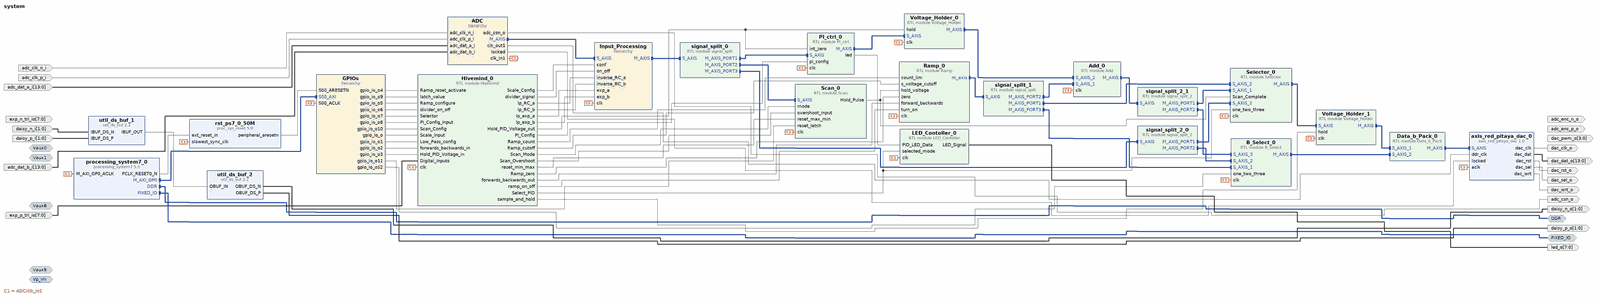
[diagram p0: block diagram of the top level, whole]
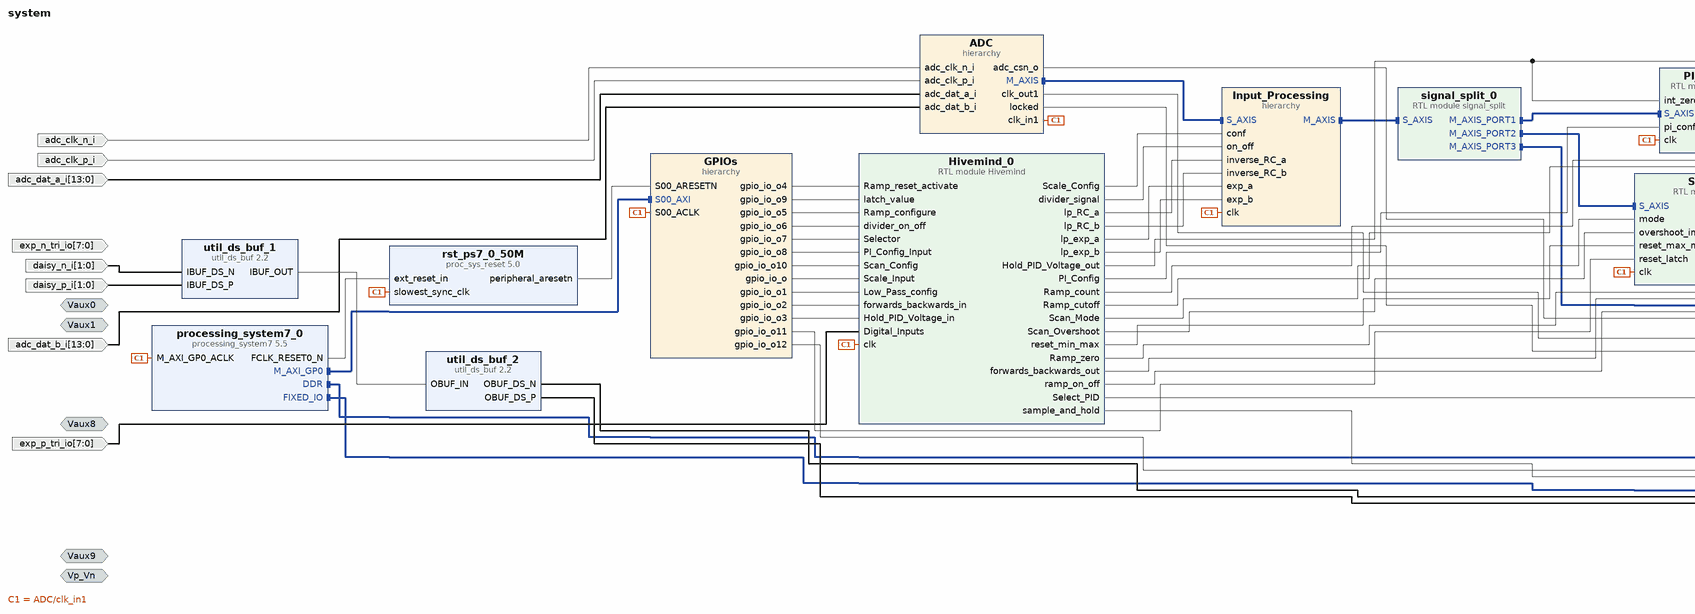
[diagram p1: block diagram of the top level, left part]
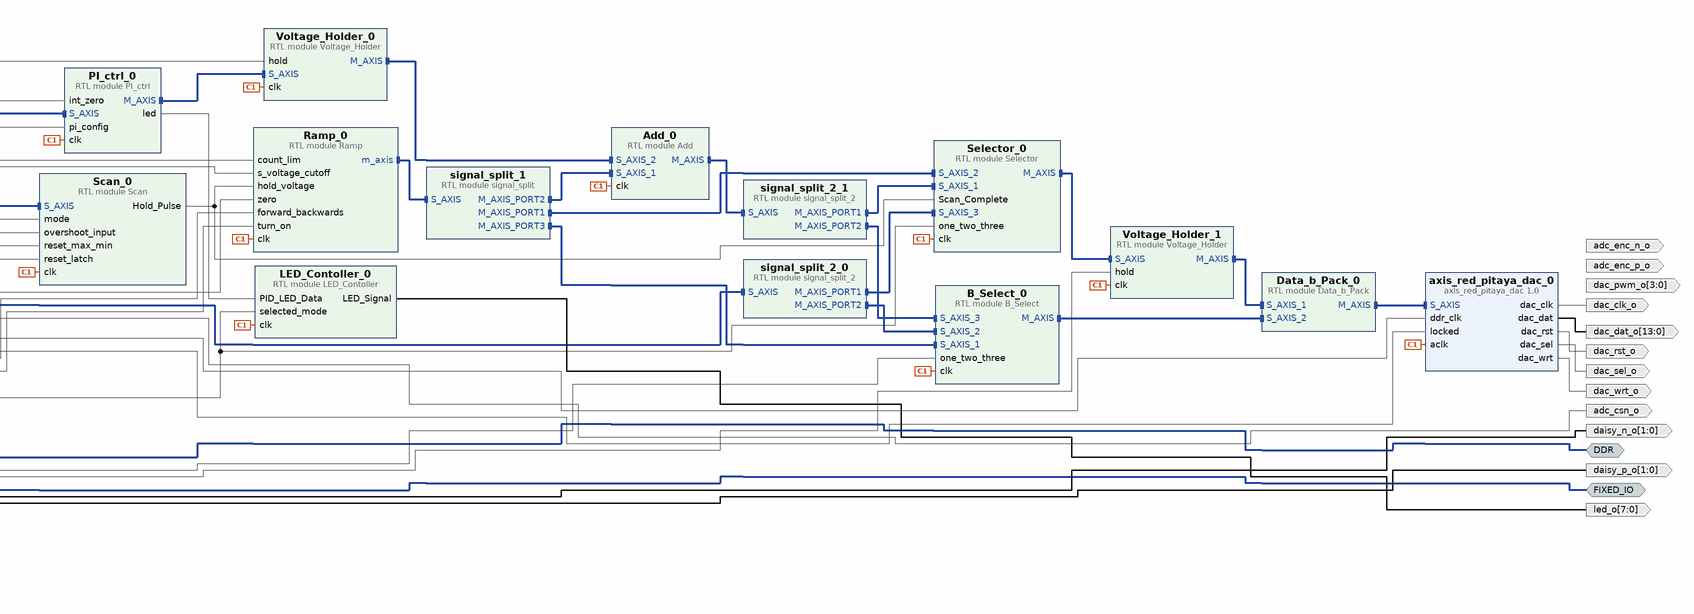
[diagram p2: block diagram of the top level, right part]
# Vivado block design system, xc7z010clg400-1, Vivado 2022.1
create_bd_design system

create_bd_intf_port -mode Slave -vlnv xilinx.com:interface:diff_analog_io_rtl:1.0 Vp_Vn
create_bd_intf_port -mode Slave -vlnv xilinx.com:interface:diff_analog_io_rtl:1.0 Vaux0
create_bd_intf_port -mode Slave -vlnv xilinx.com:interface:diff_analog_io_rtl:1.0 Vaux1
create_bd_intf_port -mode Slave -vlnv xilinx.com:interface:diff_analog_io_rtl:1.0 Vaux9
create_bd_intf_port -mode Slave -vlnv xilinx.com:interface:diff_analog_io_rtl:1.0 Vaux8
create_bd_intf_port -mode Master -vlnv xilinx.com:interface:ddrx_rtl:1.0 DDR
create_bd_intf_port -mode Master -vlnv xilinx.com:display_processing_system7:fixedio_rtl:1.0 FIXED_IO
create_bd_port -dir I -from 13 -to 0 adc_dat_a_i
create_bd_port -dir I -from 13 -to 0 adc_dat_b_i
create_bd_port -dir I adc_clk_p_i
create_bd_port -dir I adc_clk_n_i
create_bd_port -dir O adc_enc_p_o
create_bd_port -dir O adc_enc_n_o
create_bd_port -dir O adc_csn_o
create_bd_port -dir O -from 13 -to 0 dac_dat_o
create_bd_port -dir O dac_clk_o
create_bd_port -dir O dac_rst_o
create_bd_port -dir O dac_sel_o
create_bd_port -dir O dac_wrt_o
create_bd_port -dir O -from 3 -to 0 dac_pwm_o
create_bd_port -dir O -from 1 -to 0 daisy_p_o
create_bd_port -dir O -from 1 -to 0 daisy_n_o
create_bd_port -dir I -from 1 -to 0 daisy_p_i
create_bd_port -dir I -from 1 -to 0 daisy_n_i
create_bd_port -dir O -from 7 -to 0 led_o
create_bd_port -dir I -from 7 -to 0 exp_p_tri_io
create_bd_port -dir I -from 7 -to 0 exp_n_tri_io

create_bd_cell -type ip -vlnv xilinx.com:ip:util_ds_buf:2.2 util_ds_buf_1
set_property -dict {CONFIG.C_SIZE 2} [get_bd_cells util_ds_buf_1]
create_bd_cell -type ip -vlnv xilinx.com:ip:util_ds_buf:2.2 util_ds_buf_2
set_property -dict {CONFIG.C_BUF_TYPE OBUFDS CONFIG.C_SIZE 2} [get_bd_cells util_ds_buf_2]
create_bd_cell -type ip -vlnv pavel-demin:user:axis_red_pitaya_dac:1.0 axis_red_pitaya_dac_0
create_bd_cell -type hier ADC
create_bd_cell -type hier Input_Processing
create_bd_cell -type module -reference signal_split signal_split_0
create_bd_cell -type module -reference signal_split_2 signal_split_2_0
create_bd_cell -type module -reference LED_Contoller LED_Contoller_0
create_bd_cell -type module -reference PI_ctrl PI_ctrl_0
create_bd_cell -type module -reference Selector Selector_0
create_bd_cell -type module -reference Scan Scan_0
create_bd_cell -type module -reference Voltage_Holder Voltage_Holder_0
create_bd_cell -type module -reference Voltage_Holder Voltage_Holder_1
create_bd_cell -type hier GPIOs
create_bd_cell -type module -reference Hivemind Hivemind_0
create_bd_cell -type module -reference Ramp Ramp_0
create_bd_cell -type ip -vlnv xilinx.com:ip:processing_system7:5.5 processing_system7_0
# 1 more settings of processing_system7_0 are not shown: defaults, MIO pin electricals, DDR timing, and values the tool derives
create_bd_cell -type ip -vlnv xilinx.com:ip:proc_sys_reset:5.0 rst_ps7_0_50M
create_bd_cell -type module -reference Add Add_0
create_bd_cell -type module -reference signal_split signal_split_1
create_bd_cell -type module -reference signal_split_2 signal_split_2_1
create_bd_cell -type module -reference B_Select B_Select_0
create_bd_cell -type module -reference Data_b_Pack Data_b_Pack_0

# ---- hierarchy /ADC ----
current_bd_instance /ADC
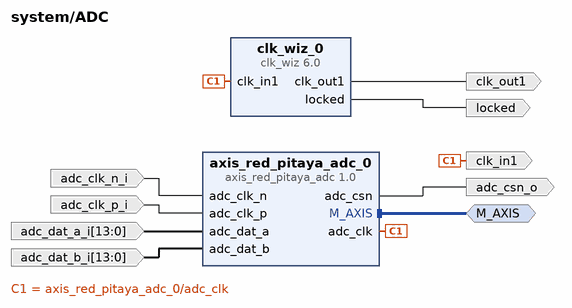
[diagram p3: block diagram inside /ADC]
create_bd_intf_pin -mode Master -vlnv xilinx.com:interface:axis_rtl:1.0 M_AXIS
create_bd_pin -dir O -type clk clk_in1
create_bd_pin -dir O adc_csn_o
create_bd_pin -dir I adc_clk_p_i
create_bd_pin -dir I adc_clk_n_i
create_bd_pin -dir I -from 13 -to 0 adc_dat_a_i
create_bd_pin -dir I -from 13 -to 0 adc_dat_b_i
create_bd_pin -dir O -type clk clk_out1
create_bd_pin -dir O locked

create_bd_cell -type ip -vlnv pavel-demin:user:axis_red_pitaya_adc:1.0 axis_red_pitaya_adc_0
create_bd_cell -type ip -vlnv xilinx.com:ip:clk_wiz:6.0 clk_wiz_0
set_property -dict [list \
  CONFIG.CLKIN1_JITTER_PS 80.0 \
  CONFIG.CLKOUT1_JITTER 104.759 \
  CONFIG.CLKOUT1_PHASE_ERROR 96.948 \
  CONFIG.CLKOUT1_REQUESTED_OUT_FREQ 250 \
  CONFIG.CLKOUT1_REQUESTED_PHASE 157.5 \
  CONFIG.MMCM_CLKFBOUT_MULT_F 8.000 \
  CONFIG.MMCM_CLKIN1_PERIOD 8.000 \
  CONFIG.MMCM_CLKOUT0_DIVIDE_F 4.000 \
  CONFIG.MMCM_CLKOUT0_PHASE 157.500 \
  CONFIG.PRIM_IN_FREQ 125 \
  CONFIG.USE_RESET false \
] [get_bd_cells clk_wiz_0]

# ---- hierarchy /Input_Processing ----
current_bd_instance /Input_Processing
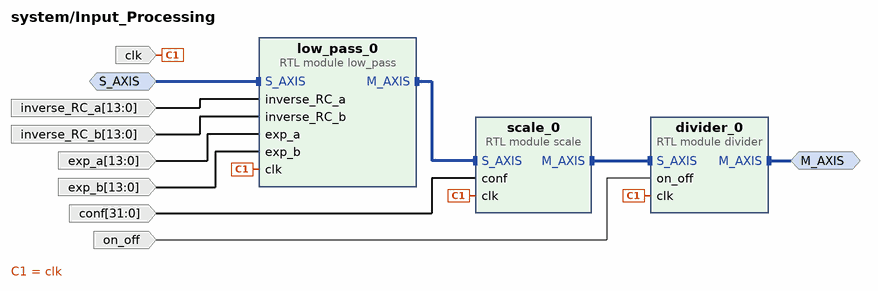
[diagram p4: block diagram inside /Input_Processing]
create_bd_intf_pin -mode Slave -vlnv xilinx.com:interface:axis_rtl:1.0 S_AXIS
create_bd_intf_pin -mode Master -vlnv xilinx.com:interface:axis_rtl:1.0 M_AXIS
create_bd_pin -dir I -type clk clk
create_bd_pin -dir I -from 13 -to 0 inverse_RC_a
create_bd_pin -dir I -from 13 -to 0 inverse_RC_b
create_bd_pin -dir I -from 13 -to 0 exp_a
create_bd_pin -dir I -from 13 -to 0 exp_b
create_bd_pin -dir I on_off
create_bd_pin -dir I -from 31 -to 0 conf

create_bd_cell -type module -reference low_pass low_pass_0
create_bd_cell -type module -reference scale scale_0
create_bd_cell -type module -reference divider divider_0

# ---- hierarchy /GPIOs ----
current_bd_instance /GPIOs
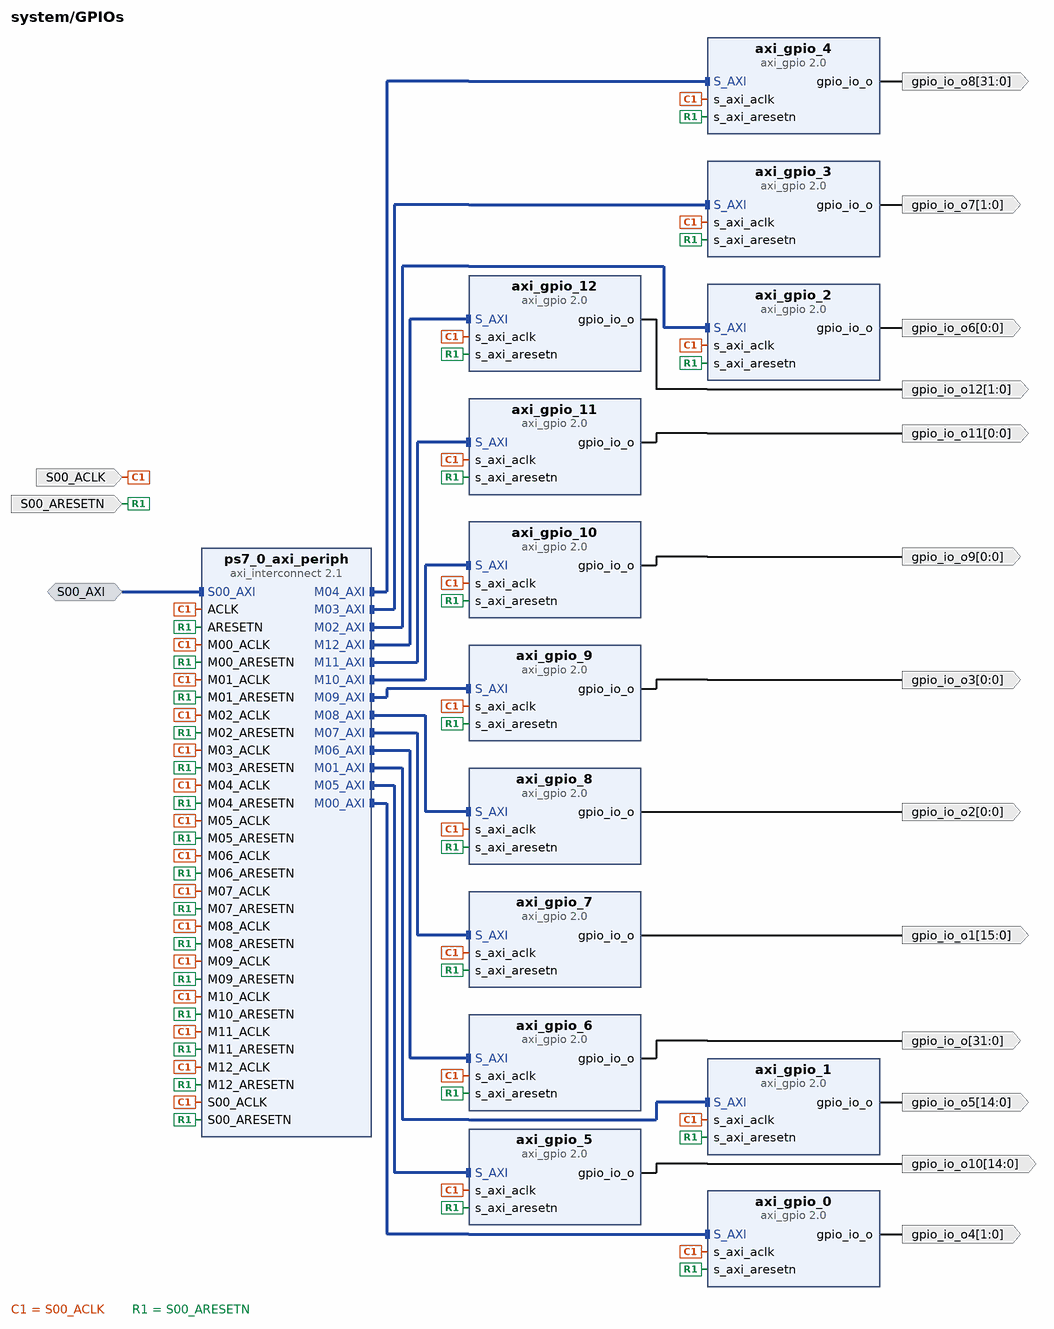
[diagram p5: block diagram inside /GPIOs]
create_bd_intf_pin -mode Slave -vlnv xilinx.com:interface:aximm_rtl:1.0 S00_AXI
create_bd_pin -dir I -type clk S00_ACLK
create_bd_pin -dir I -type rst S00_ARESETN
create_bd_pin -dir O -from 31 -to 0 gpio_io_o
create_bd_pin -dir O -from 15 -to 0 gpio_io_o1
create_bd_pin -dir O -from 0 -to 0 gpio_io_o2
create_bd_pin -dir O -from 0 -to 0 gpio_io_o3
create_bd_pin -dir O -from 1 -to 0 gpio_io_o4
create_bd_pin -dir O -from 14 -to 0 gpio_io_o5
create_bd_pin -dir O -from 0 -to 0 gpio_io_o6
create_bd_pin -dir O -from 1 -to 0 gpio_io_o7
create_bd_pin -dir O -from 31 -to 0 gpio_io_o8
create_bd_pin -dir O -from 0 -to 0 gpio_io_o9
create_bd_pin -dir O -from 14 -to 0 gpio_io_o10
create_bd_pin -dir O -from 0 -to 0 gpio_io_o11
create_bd_pin -dir O -from 1 -to 0 gpio_io_o12

create_bd_cell -type ip -vlnv xilinx.com:ip:axi_gpio:2.0 axi_gpio_6
set_property -dict {CONFIG.C_ALL_OUTPUTS 1 CONFIG.C_GPIO_WIDTH 32} [get_bd_cells axi_gpio_6]
create_bd_cell -type ip -vlnv xilinx.com:ip:axi_gpio:2.0 axi_gpio_7
set_property -dict {CONFIG.C_ALL_OUTPUTS 1 CONFIG.C_GPIO_WIDTH 16} [get_bd_cells axi_gpio_7]
create_bd_cell -type ip -vlnv xilinx.com:ip:axi_gpio:2.0 axi_gpio_8
set_property -dict {CONFIG.C_ALL_OUTPUTS 1 CONFIG.C_GPIO_WIDTH 1} [get_bd_cells axi_gpio_8]
create_bd_cell -type ip -vlnv xilinx.com:ip:axi_gpio:2.0 axi_gpio_9
set_property -dict {CONFIG.C_ALL_OUTPUTS 1 CONFIG.C_GPIO_WIDTH 1} [get_bd_cells axi_gpio_9]
create_bd_cell -type ip -vlnv xilinx.com:ip:axi_gpio:2.0 axi_gpio_0
set_property -dict {CONFIG.C_ALL_OUTPUTS 1 CONFIG.C_GPIO_WIDTH 2} [get_bd_cells axi_gpio_0]
create_bd_cell -type ip -vlnv xilinx.com:ip:axi_gpio:2.0 axi_gpio_1
set_property -dict {CONFIG.C_ALL_OUTPUTS 1 CONFIG.C_GPIO_WIDTH 15} [get_bd_cells axi_gpio_1]
create_bd_cell -type ip -vlnv xilinx.com:ip:axi_gpio:2.0 axi_gpio_2
set_property -dict {CONFIG.C_ALL_OUTPUTS 1 CONFIG.C_GPIO_WIDTH 1} [get_bd_cells axi_gpio_2]
create_bd_cell -type ip -vlnv xilinx.com:ip:axi_gpio:2.0 axi_gpio_3
set_property -dict {CONFIG.C_ALL_OUTPUTS 1 CONFIG.C_GPIO_WIDTH 2} [get_bd_cells axi_gpio_3]
create_bd_cell -type ip -vlnv xilinx.com:ip:axi_gpio:2.0 axi_gpio_4
set_property -dict {CONFIG.C_ALL_OUTPUTS 1 CONFIG.C_GPIO_WIDTH 32} [get_bd_cells axi_gpio_4]
create_bd_cell -type ip -vlnv xilinx.com:ip:axi_gpio:2.0 axi_gpio_10
set_property -dict {CONFIG.C_ALL_OUTPUTS 1 CONFIG.C_GPIO_WIDTH 1} [get_bd_cells axi_gpio_10]
create_bd_cell -type ip -vlnv xilinx.com:ip:axi_gpio:2.0 axi_gpio_5
set_property -dict {CONFIG.C_ALL_OUTPUTS 1 CONFIG.C_GPIO_WIDTH 15} [get_bd_cells axi_gpio_5]
create_bd_cell -type ip -vlnv xilinx.com:ip:axi_gpio:2.0 axi_gpio_11
set_property -dict {CONFIG.C_ALL_OUTPUTS 1 CONFIG.C_GPIO_WIDTH 1} [get_bd_cells axi_gpio_11]
create_bd_cell -type ip -vlnv xilinx.com:ip:axi_interconnect:2.1 ps7_0_axi_periph
set_property -dict {CONFIG.NUM_MI 13} [get_bd_cells ps7_0_axi_periph]
create_bd_cell -type ip -vlnv xilinx.com:ip:axi_gpio:2.0 axi_gpio_12
set_property -dict {CONFIG.C_ALL_OUTPUTS 1 CONFIG.C_GPIO_WIDTH 2} [get_bd_cells axi_gpio_12]

# ---- connections ----

current_bd_instance /ADC
connect_bd_intf_net [get_bd_intf_pins M_AXIS] [get_bd_intf_pins axis_red_pitaya_adc_0/M_AXIS]
connect_bd_net [get_bd_pins adc_clk_n_i] [get_bd_pins axis_red_pitaya_adc_0/adc_clk_n]
connect_bd_net [get_bd_pins adc_clk_p_i] [get_bd_pins axis_red_pitaya_adc_0/adc_clk_p]
connect_bd_net [get_bd_pins adc_dat_a_i] [get_bd_pins axis_red_pitaya_adc_0/adc_dat_a]
connect_bd_net [get_bd_pins adc_dat_b_i] [get_bd_pins axis_red_pitaya_adc_0/adc_dat_b]
connect_bd_net [get_bd_pins axis_red_pitaya_adc_0/adc_clk] [get_bd_pins clk_in1] [get_bd_pins clk_wiz_0/clk_in1]
connect_bd_net [get_bd_pins axis_red_pitaya_adc_0/adc_csn] [get_bd_pins adc_csn_o]
connect_bd_net [get_bd_pins clk_wiz_0/clk_out1] [get_bd_pins clk_out1]
connect_bd_net [get_bd_pins clk_wiz_0/locked] [get_bd_pins locked]

current_bd_instance /Input_Processing
connect_bd_intf_net -intf_net axis_red_pitaya_adc_0_M_AXIS [get_bd_intf_pins S_AXIS] [get_bd_intf_pins low_pass_0/S_AXIS]
connect_bd_intf_net [get_bd_intf_pins M_AXIS] [get_bd_intf_pins divider_0/M_AXIS]
connect_bd_intf_net [get_bd_intf_pins low_pass_0/M_AXIS] [get_bd_intf_pins scale_0/S_AXIS]
connect_bd_intf_net [get_bd_intf_pins scale_0/M_AXIS] [get_bd_intf_pins divider_0/S_AXIS]
connect_bd_net -net Controller_Scale_Config [get_bd_pins conf] [get_bd_pins scale_0/conf]
connect_bd_net -net Controller_lp_RC_a [get_bd_pins inverse_RC_a] [get_bd_pins low_pass_0/inverse_RC_a]
connect_bd_net -net Controller_lp_RC_b [get_bd_pins inverse_RC_b] [get_bd_pins low_pass_0/inverse_RC_b]
connect_bd_net -net Controller_lp_exp_a [get_bd_pins exp_a] [get_bd_pins low_pass_0/exp_a]
connect_bd_net -net Controller_lp_exp_b [get_bd_pins exp_b] [get_bd_pins low_pass_0/exp_b]
connect_bd_net -net Hivemind_0_divider_signal [get_bd_pins on_off] [get_bd_pins divider_0/on_off]
connect_bd_net -net axis_red_pitaya_adc_0_adc_clk [get_bd_pins clk] [get_bd_pins scale_0/clk] [get_bd_pins low_pass_0/clk] [get_bd_pins divider_0/clk]

current_bd_instance /GPIOs
connect_bd_intf_net -intf_net processing_system7_0_M_AXI_GP0 [get_bd_intf_pins S00_AXI] [get_bd_intf_pins ps7_0_axi_periph/S00_AXI]
connect_bd_intf_net [get_bd_intf_pins ps7_0_axi_periph/M00_AXI] [get_bd_intf_pins axi_gpio_0/S_AXI]
connect_bd_intf_net [get_bd_intf_pins ps7_0_axi_periph/M01_AXI] [get_bd_intf_pins axi_gpio_1/S_AXI]
connect_bd_intf_net [get_bd_intf_pins ps7_0_axi_periph/M02_AXI] [get_bd_intf_pins axi_gpio_2/S_AXI]
connect_bd_intf_net [get_bd_intf_pins ps7_0_axi_periph/M03_AXI] [get_bd_intf_pins axi_gpio_3/S_AXI]
connect_bd_intf_net [get_bd_intf_pins ps7_0_axi_periph/M04_AXI] [get_bd_intf_pins axi_gpio_4/S_AXI]
connect_bd_intf_net [get_bd_intf_pins ps7_0_axi_periph/M05_AXI] [get_bd_intf_pins axi_gpio_5/S_AXI]
connect_bd_intf_net [get_bd_intf_pins ps7_0_axi_periph/M06_AXI] [get_bd_intf_pins axi_gpio_6/S_AXI]
connect_bd_intf_net [get_bd_intf_pins ps7_0_axi_periph/M07_AXI] [get_bd_intf_pins axi_gpio_7/S_AXI]
connect_bd_intf_net [get_bd_intf_pins ps7_0_axi_periph/M08_AXI] [get_bd_intf_pins axi_gpio_8/S_AXI]
connect_bd_intf_net [get_bd_intf_pins ps7_0_axi_periph/M09_AXI] [get_bd_intf_pins axi_gpio_9/S_AXI]
connect_bd_intf_net [get_bd_intf_pins ps7_0_axi_periph/M10_AXI] [get_bd_intf_pins axi_gpio_10/S_AXI]
connect_bd_intf_net [get_bd_intf_pins ps7_0_axi_periph/M11_AXI] [get_bd_intf_pins axi_gpio_11/S_AXI]
connect_bd_intf_net [get_bd_intf_pins ps7_0_axi_periph/M12_AXI] [get_bd_intf_pins axi_gpio_12/S_AXI]
connect_bd_net [get_bd_pins axi_gpio_0/gpio_io_o] [get_bd_pins gpio_io_o4]
connect_bd_net [get_bd_pins axi_gpio_10/gpio_io_o] [get_bd_pins gpio_io_o9]
connect_bd_net [get_bd_pins axi_gpio_11/gpio_io_o] [get_bd_pins gpio_io_o11]
connect_bd_net [get_bd_pins axi_gpio_12/gpio_io_o] [get_bd_pins gpio_io_o12]
connect_bd_net [get_bd_pins axi_gpio_1/gpio_io_o] [get_bd_pins gpio_io_o5]
connect_bd_net [get_bd_pins axi_gpio_2/gpio_io_o] [get_bd_pins gpio_io_o6]
connect_bd_net [get_bd_pins axi_gpio_3/gpio_io_o] [get_bd_pins gpio_io_o7]
connect_bd_net [get_bd_pins axi_gpio_4/gpio_io_o] [get_bd_pins gpio_io_o8]
connect_bd_net [get_bd_pins axi_gpio_5/gpio_io_o] [get_bd_pins gpio_io_o10]
connect_bd_net [get_bd_pins axi_gpio_6/gpio_io_o] [get_bd_pins gpio_io_o]
connect_bd_net [get_bd_pins axi_gpio_7/gpio_io_o] [get_bd_pins gpio_io_o1]
connect_bd_net [get_bd_pins axi_gpio_8/gpio_io_o] [get_bd_pins gpio_io_o2]
connect_bd_net [get_bd_pins axi_gpio_9/gpio_io_o] [get_bd_pins gpio_io_o3]
connect_bd_net -net processing_system7_0_FCLK_CLK0 [get_bd_pins S00_ACLK] \
  [get_bd_pins ps7_0_axi_periph/S00_ACLK] [get_bd_pins axi_gpio_0/s_axi_aclk] [get_bd_pins ps7_0_axi_periph/M00_ACLK] \
  [get_bd_pins ps7_0_axi_periph/ACLK] [get_bd_pins axi_gpio_1/s_axi_aclk] [get_bd_pins ps7_0_axi_periph/M01_ACLK] \
  [get_bd_pins axi_gpio_2/s_axi_aclk] [get_bd_pins ps7_0_axi_periph/M02_ACLK] [get_bd_pins axi_gpio_3/s_axi_aclk] \
  [get_bd_pins ps7_0_axi_periph/M03_ACLK] [get_bd_pins axi_gpio_4/s_axi_aclk] [get_bd_pins ps7_0_axi_periph/M04_ACLK] \
  [get_bd_pins axi_gpio_5/s_axi_aclk] [get_bd_pins ps7_0_axi_periph/M05_ACLK] [get_bd_pins ps7_0_axi_periph/M06_ACLK] \
  [get_bd_pins axi_gpio_7/s_axi_aclk] [get_bd_pins ps7_0_axi_periph/M07_ACLK] [get_bd_pins axi_gpio_8/s_axi_aclk] \
  [get_bd_pins ps7_0_axi_periph/M08_ACLK] [get_bd_pins axi_gpio_9/s_axi_aclk] [get_bd_pins ps7_0_axi_periph/M09_ACLK] \
  [get_bd_pins axi_gpio_10/s_axi_aclk] [get_bd_pins ps7_0_axi_periph/M10_ACLK] [get_bd_pins axi_gpio_11/s_axi_aclk] \
  [get_bd_pins ps7_0_axi_periph/M11_ACLK] [get_bd_pins axi_gpio_6/s_axi_aclk] [get_bd_pins ps7_0_axi_periph/M12_ACLK] \
  [get_bd_pins axi_gpio_12/s_axi_aclk]
connect_bd_net -net rst_ps7_0_50M_peripheral_aresetn [get_bd_pins S00_ARESETN] \
  [get_bd_pins ps7_0_axi_periph/S00_ARESETN] [get_bd_pins axi_gpio_0/s_axi_aresetn] \
  [get_bd_pins ps7_0_axi_periph/M00_ARESETN] [get_bd_pins ps7_0_axi_periph/ARESETN] [get_bd_pins axi_gpio_1/s_axi_aresetn] \
  [get_bd_pins ps7_0_axi_periph/M01_ARESETN] [get_bd_pins axi_gpio_2/s_axi_aresetn] \
  [get_bd_pins ps7_0_axi_periph/M02_ARESETN] [get_bd_pins axi_gpio_3/s_axi_aresetn] \
  [get_bd_pins ps7_0_axi_periph/M03_ARESETN] [get_bd_pins axi_gpio_4/s_axi_aresetn] \
  [get_bd_pins ps7_0_axi_periph/M04_ARESETN] [get_bd_pins axi_gpio_5/s_axi_aresetn] \
  [get_bd_pins ps7_0_axi_periph/M05_ARESETN] [get_bd_pins ps7_0_axi_periph/M06_ARESETN] \
  [get_bd_pins axi_gpio_7/s_axi_aresetn] [get_bd_pins ps7_0_axi_periph/M07_ARESETN] [get_bd_pins axi_gpio_8/s_axi_aresetn] \
  [get_bd_pins ps7_0_axi_periph/M08_ARESETN] [get_bd_pins axi_gpio_9/s_axi_aresetn] \
  [get_bd_pins ps7_0_axi_periph/M09_ARESETN] [get_bd_pins axi_gpio_10/s_axi_aresetn] \
  [get_bd_pins ps7_0_axi_periph/M10_ARESETN] [get_bd_pins axi_gpio_11/s_axi_aresetn] \
  [get_bd_pins ps7_0_axi_periph/M11_ARESETN] [get_bd_pins axi_gpio_6/s_axi_aresetn] \
  [get_bd_pins ps7_0_axi_periph/M12_ARESETN] [get_bd_pins axi_gpio_12/s_axi_aresetn]

current_bd_instance /
connect_bd_intf_net [get_bd_intf_pins Add_0/M_AXIS] [get_bd_intf_pins signal_split_2_1/S_AXIS]
connect_bd_intf_net [get_bd_intf_pins B_Select_0/M_AXIS] [get_bd_intf_pins Data_b_Pack_0/S_AXIS_2]
connect_bd_intf_net [get_bd_intf_pins Data_b_Pack_0/M_AXIS] [get_bd_intf_pins axis_red_pitaya_dac_0/S_AXIS]
connect_bd_intf_net [get_bd_intf_pins Input_Processing/M_AXIS] [get_bd_intf_pins signal_split_0/S_AXIS]
connect_bd_intf_net [get_bd_intf_pins PI_ctrl_0/M_AXIS] [get_bd_intf_pins Voltage_Holder_0/S_AXIS]
connect_bd_intf_net [get_bd_intf_pins Ramp_0/m_axis] [get_bd_intf_pins signal_split_1/S_AXIS]
connect_bd_intf_net [get_bd_intf_pins Selector_0/M_AXIS] [get_bd_intf_pins Voltage_Holder_1/S_AXIS]
connect_bd_intf_net [get_bd_intf_pins Voltage_Holder_0/M_AXIS] [get_bd_intf_pins Add_0/S_AXIS_2]
connect_bd_intf_net [get_bd_intf_pins Voltage_Holder_1/M_AXIS] [get_bd_intf_pins Data_b_Pack_0/S_AXIS_1]
connect_bd_intf_net -intf_net axis_red_pitaya_adc_0_M_AXIS [get_bd_intf_pins Input_Processing/S_AXIS] [get_bd_intf_pins ADC/M_AXIS]
connect_bd_intf_net [get_bd_intf_ports DDR] [get_bd_intf_pins processing_system7_0/DDR]
connect_bd_intf_net [get_bd_intf_ports FIXED_IO] [get_bd_intf_pins processing_system7_0/FIXED_IO]
connect_bd_intf_net [get_bd_intf_pins processing_system7_0/M_AXI_GP0] [get_bd_intf_pins GPIOs/S00_AXI]
connect_bd_intf_net [get_bd_intf_pins signal_split_0/M_AXIS_PORT1] [get_bd_intf_pins PI_ctrl_0/S_AXIS]
connect_bd_intf_net [get_bd_intf_pins signal_split_0/M_AXIS_PORT2] [get_bd_intf_pins Scan_0/S_AXIS]
connect_bd_intf_net [get_bd_intf_pins signal_split_0/M_AXIS_PORT3] [get_bd_intf_pins signal_split_2_0/S_AXIS]
connect_bd_intf_net [get_bd_intf_pins signal_split_1/M_AXIS_PORT1] [get_bd_intf_pins Selector_0/S_AXIS_2]
connect_bd_intf_net [get_bd_intf_pins signal_split_1/M_AXIS_PORT2] [get_bd_intf_pins Add_0/S_AXIS_1]
connect_bd_intf_net [get_bd_intf_pins signal_split_1/M_AXIS_PORT3] [get_bd_intf_pins B_Select_0/S_AXIS_1]
connect_bd_intf_net [get_bd_intf_pins signal_split_2_0/M_AXIS_PORT1] [get_bd_intf_pins Selector_0/S_AXIS_3]
connect_bd_intf_net [get_bd_intf_pins signal_split_2_0/M_AXIS_PORT2] [get_bd_intf_pins B_Select_0/S_AXIS_2]
connect_bd_intf_net [get_bd_intf_pins signal_split_2_1/M_AXIS_PORT1] [get_bd_intf_pins Selector_0/S_AXIS_1]
connect_bd_intf_net [get_bd_intf_pins signal_split_2_1/M_AXIS_PORT2] [get_bd_intf_pins B_Select_0/S_AXIS_3]
connect_bd_net [get_bd_pins GPIOs/gpio_io_o12] [get_bd_pins B_Select_0/one_two_three]
connect_bd_net [get_bd_pins Hivemind_0/Hold_PID_Voltage_out] [get_bd_pins PI_ctrl_0/int_zero] [get_bd_pins Voltage_Holder_0/hold]
connect_bd_net [get_bd_pins Hivemind_0/PI_Config] [get_bd_pins PI_ctrl_0/pi_config]
connect_bd_net [get_bd_pins Hivemind_0/Ramp_count] [get_bd_pins Ramp_0/count_lim]
connect_bd_net [get_bd_pins Hivemind_0/Ramp_cutoff] [get_bd_pins Ramp_0/s_voltage_cutoff]
connect_bd_net -net Hivemind_0_Ramp_reset [get_bd_pins Hivemind_0/Ramp_zero] [get_bd_pins Ramp_0/zero]
connect_bd_net [get_bd_pins Hivemind_0/Scale_Config] [get_bd_pins Input_Processing/conf]
connect_bd_net [get_bd_pins Hivemind_0/Scan_Mode] [get_bd_pins Scan_0/mode]
connect_bd_net [get_bd_pins Hivemind_0/Scan_Overshoot] [get_bd_pins Scan_0/overshoot_input]
connect_bd_net [get_bd_pins Hivemind_0/Select_PID] [get_bd_pins LED_Contoller_0/selected_mode] [get_bd_pins Selector_0/one_two_three]
connect_bd_net [get_bd_pins Hivemind_0/divider_signal] [get_bd_pins Input_Processing/on_off]
connect_bd_net [get_bd_pins Hivemind_0/forwards_backwards_out] [get_bd_pins Ramp_0/forward_backwards]
connect_bd_net [get_bd_pins Hivemind_0/lp_RC_a] [get_bd_pins Input_Processing/inverse_RC_a]
connect_bd_net [get_bd_pins Hivemind_0/lp_RC_b] [get_bd_pins Input_Processing/inverse_RC_b]
connect_bd_net [get_bd_pins Hivemind_0/lp_exp_a] [get_bd_pins Input_Processing/exp_a]
connect_bd_net [get_bd_pins Hivemind_0/lp_exp_b] [get_bd_pins Input_Processing/exp_b]
connect_bd_net [get_bd_pins Hivemind_0/ramp_on_off] [get_bd_pins Ramp_0/turn_on]
connect_bd_net [get_bd_pins Hivemind_0/reset_min_max] [get_bd_pins Scan_0/reset_max_min]
connect_bd_net [get_bd_pins Hivemind_0/sample_and_hold] [get_bd_pins Voltage_Holder_1/hold]
connect_bd_net [get_bd_pins LED_Contoller_0/LED_Signal] [get_bd_ports led_o]
connect_bd_net [get_bd_pins PI_ctrl_0/led] [get_bd_pins LED_Contoller_0/PID_LED_Data]
connect_bd_net [get_bd_pins Scan_0/Hold_Pulse] [get_bd_pins Selector_0/Scan_Complete] [get_bd_pins Ramp_0/hold_voltage]
connect_bd_net [get_bd_ports adc_clk_n_i] [get_bd_pins ADC/adc_clk_n_i]
connect_bd_net [get_bd_ports adc_clk_p_i] [get_bd_pins ADC/adc_clk_p_i]
connect_bd_net [get_bd_ports adc_dat_a_i] [get_bd_pins ADC/adc_dat_a_i]
connect_bd_net [get_bd_ports adc_dat_b_i] [get_bd_pins ADC/adc_dat_b_i]
connect_bd_net -net axi_gpio_0_gpio_io_o [get_bd_pins GPIOs/gpio_io_o4] [get_bd_pins Hivemind_0/Ramp_reset_activate]
connect_bd_net -net axi_gpio_10_gpio_io_o [get_bd_pins GPIOs/gpio_io_o9] [get_bd_pins Hivemind_0/latch_value]
connect_bd_net -net axi_gpio_11_gpio_io_o [get_bd_pins GPIOs/gpio_io_o11] [get_bd_pins Scan_0/reset_latch]
connect_bd_net -net axi_gpio_1_gpio_io_o [get_bd_pins GPIOs/gpio_io_o5] [get_bd_pins Hivemind_0/Ramp_configure]
connect_bd_net -net axi_gpio_2_gpio_io_o [get_bd_pins GPIOs/gpio_io_o6] [get_bd_pins Hivemind_0/divider_on_off]
connect_bd_net -net axi_gpio_3_gpio_io_o [get_bd_pins GPIOs/gpio_io_o7] [get_bd_pins Hivemind_0/Selector]
connect_bd_net -net axi_gpio_4_gpio_io_o [get_bd_pins GPIOs/gpio_io_o8] [get_bd_pins Hivemind_0/PI_Config_Input]
connect_bd_net -net axi_gpio_5_gpio_io_o [get_bd_pins GPIOs/gpio_io_o10] [get_bd_pins Hivemind_0/Scan_Config]
connect_bd_net -net axi_gpio_6_gpio_io_o [get_bd_pins GPIOs/gpio_io_o] [get_bd_pins Hivemind_0/Scale_Input]
connect_bd_net -net axi_gpio_7_gpio_io_o [get_bd_pins GPIOs/gpio_io_o1] [get_bd_pins Hivemind_0/Low_Pass_config]
connect_bd_net -net axi_gpio_8_gpio_io_o [get_bd_pins GPIOs/gpio_io_o2] [get_bd_pins Hivemind_0/forwards_backwards_in]
connect_bd_net -net axi_gpio_9_gpio_io_o [get_bd_pins GPIOs/gpio_io_o3] [get_bd_pins Hivemind_0/Hold_PID_Voltage_in]
connect_bd_net -net axis_red_pitaya_adc_0_adc_clk [get_bd_pins ADC/clk_in1] \
  [get_bd_pins axis_red_pitaya_dac_0/aclk] [get_bd_pins Input_Processing/clk] [get_bd_pins PI_ctrl_0/clk] \
  [get_bd_pins Selector_0/clk] [get_bd_pins Scan_0/clk] [get_bd_pins Voltage_Holder_0/clk] [get_bd_pins Voltage_Holder_1/clk] \
  [get_bd_pins LED_Contoller_0/clk] [get_bd_pins Hivemind_0/clk] [get_bd_pins Ramp_0/clk] \
  [get_bd_pins processing_system7_0/M_AXI_GP0_ACLK] [get_bd_pins rst_ps7_0_50M/slowest_sync_clk] [get_bd_pins GPIOs/S00_ACLK] \
  [get_bd_pins Add_0/clk] [get_bd_pins B_Select_0/clk]
connect_bd_net -net axis_red_pitaya_adc_0_adc_csn [get_bd_pins ADC/adc_csn_o] [get_bd_ports adc_csn_o]
connect_bd_net [get_bd_pins axis_red_pitaya_dac_0/dac_clk] [get_bd_ports dac_clk_o]
connect_bd_net [get_bd_pins axis_red_pitaya_dac_0/dac_dat] [get_bd_ports dac_dat_o]
connect_bd_net [get_bd_pins axis_red_pitaya_dac_0/dac_rst] [get_bd_ports dac_rst_o]
connect_bd_net [get_bd_pins axis_red_pitaya_dac_0/dac_sel] [get_bd_ports dac_sel_o]
connect_bd_net [get_bd_pins axis_red_pitaya_dac_0/dac_wrt] [get_bd_ports dac_wrt_o]
connect_bd_net -net clk_wiz_0_clk_out1 [get_bd_pins ADC/clk_out1] [get_bd_pins axis_red_pitaya_dac_0/ddr_clk]
connect_bd_net -net clk_wiz_0_locked [get_bd_pins ADC/locked] [get_bd_pins axis_red_pitaya_dac_0/locked]
connect_bd_net [get_bd_ports daisy_n_i] [get_bd_pins util_ds_buf_1/IBUF_DS_N]
connect_bd_net [get_bd_ports daisy_p_i] [get_bd_pins util_ds_buf_1/IBUF_DS_P]
connect_bd_net [get_bd_ports exp_p_tri_io] [get_bd_pins Hivemind_0/Digital_Inputs]
connect_bd_net [get_bd_pins processing_system7_0/FCLK_RESET0_N] [get_bd_pins rst_ps7_0_50M/ext_reset_in]
connect_bd_net [get_bd_pins rst_ps7_0_50M/peripheral_aresetn] [get_bd_pins GPIOs/S00_ARESETN]
connect_bd_net [get_bd_pins util_ds_buf_1/IBUF_OUT] [get_bd_pins util_ds_buf_2/OBUF_IN]
connect_bd_net [get_bd_pins util_ds_buf_2/OBUF_DS_N] [get_bd_ports daisy_n_o]
connect_bd_net [get_bd_pins util_ds_buf_2/OBUF_DS_P] [get_bd_ports daisy_p_o]

# ---- address map ----
assign_bd_address -offset 0x41200000 -range 64K -target_address_space [get_bd_addr_spaces processing_system7_0/Data] [get_bd_addr_segs GPIOs/axi_gpio_0/S_AXI/Reg]
assign_bd_address -offset 0x41210000 -range 64K -target_address_space [get_bd_addr_spaces processing_system7_0/Data] [get_bd_addr_segs GPIOs/axi_gpio_1/S_AXI/Reg]
assign_bd_address -offset 0x41220000 -range 64K -target_address_space [get_bd_addr_spaces processing_system7_0/Data] [get_bd_addr_segs GPIOs/axi_gpio_2/S_AXI/Reg]
assign_bd_address -offset 0x41230000 -range 64K -target_address_space [get_bd_addr_spaces processing_system7_0/Data] [get_bd_addr_segs GPIOs/axi_gpio_3/S_AXI/Reg]
assign_bd_address -offset 0x41240000 -range 64K -target_address_space [get_bd_addr_spaces processing_system7_0/Data] [get_bd_addr_segs GPIOs/axi_gpio_4/S_AXI/Reg]
assign_bd_address -offset 0x41250000 -range 64K -target_address_space [get_bd_addr_spaces processing_system7_0/Data] [get_bd_addr_segs GPIOs/axi_gpio_5/S_AXI/Reg]
assign_bd_address -offset 0x41260000 -range 64K -target_address_space [get_bd_addr_spaces processing_system7_0/Data] [get_bd_addr_segs GPIOs/axi_gpio_6/S_AXI/Reg]
assign_bd_address -offset 0x41270000 -range 64K -target_address_space [get_bd_addr_spaces processing_system7_0/Data] [get_bd_addr_segs GPIOs/axi_gpio_7/S_AXI/Reg]
assign_bd_address -offset 0x41280000 -range 64K -target_address_space [get_bd_addr_spaces processing_system7_0/Data] [get_bd_addr_segs GPIOs/axi_gpio_8/S_AXI/Reg]
assign_bd_address -offset 0x41290000 -range 64K -target_address_space [get_bd_addr_spaces processing_system7_0/Data] [get_bd_addr_segs GPIOs/axi_gpio_9/S_AXI/Reg]
assign_bd_address -offset 0x412A0000 -range 64K -target_address_space [get_bd_addr_spaces processing_system7_0/Data] [get_bd_addr_segs GPIOs/axi_gpio_10/S_AXI/Reg]
assign_bd_address -offset 0x412B0000 -range 64K -target_address_space [get_bd_addr_spaces processing_system7_0/Data] [get_bd_addr_segs GPIOs/axi_gpio_11/S_AXI/Reg]
assign_bd_address -offset 0x412C0000 -range 64K -target_address_space [get_bd_addr_spaces processing_system7_0/Data] [get_bd_addr_segs GPIOs/axi_gpio_12/S_AXI/Reg]

validate_bd_design
save_bd_design
